# EAGLE design breakout (EAGLE 7.5.0)
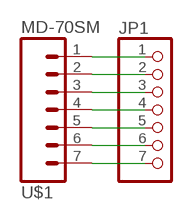
[diagram p0: schematic, sheet 1]

## Parts
JP1  PINHD-1X7  [1X07]
U$1  MD-70SM  [MD-70SM]

## Nets
N$1: JP1.7 U$1.7
N$2: JP1.5 U$1.5
N$3: JP1.6 U$1.6
N$4: JP1.3 U$1.3
N$5: JP1.1 U$1.1
N$6: JP1.2 U$1.2
N$7: JP1.4 U$1.4

## Library data of the parts
JP1 = pinhead:PINHD-1X7: PIN HEADER
U$1 = con-cui:MD-70SM

## Board
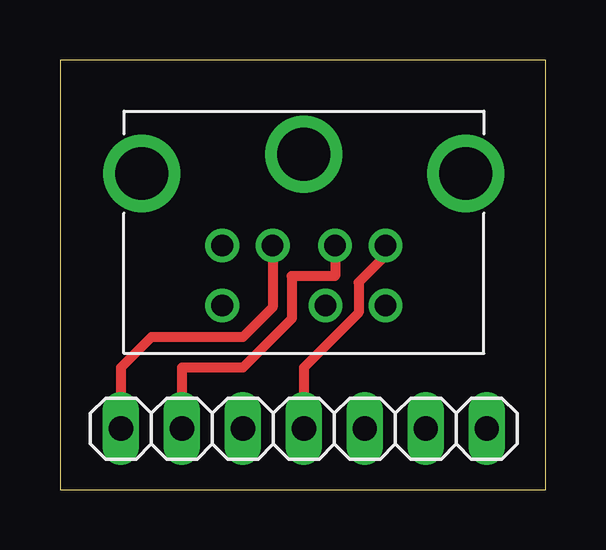
[diagram p1: board, top side]
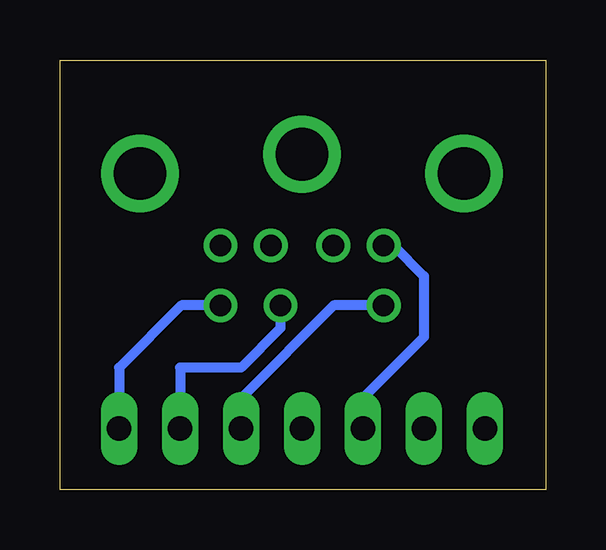
[diagram p2: board, bottom side, seen from below]

Size 20.24 x 17.9 mm. Coordinates in mm from the lower left corner, seen from the top.
Outline: 0,0 20.24,0 20.24,17.9 0,17.9 0,0
Copper layers (1*16): Top 0.035mm / dielectric 1.5mm / Bottom 0.035mm
Design rules "default": minimum track width 10mil, minimum drill 24mil, track to track 8mil, track to pad 8mil, pad to pad 8mil, via to via 8mil, smd to smd 8mil, copper to edge 40mil, drill to drill 8mil, minimum pad ring 10mil, minimum via ring 8mil, stop-mask expansion 4mil, vias tented up to drill 0mil, thermal gap 10mil

### Footprints (pad centres in the part's own frame; a part is rotated, then mirrored left to right if it is on the bottom)
1X07 = drill 1.016 long: 1 -7.62,0; 2 -5.08,0; 3 -2.54,0; 4 0,0; 5 2.54,0; 6 5.08,0; 7 7.62,0
MD-70SM = drill 0.9: 1 -1.3,-3.8; 2 1.3,-3.8; 3 -3.4,-3.8; 4 3.4,-3.8; 5 -3.4,-6.3; 6 0.9,-6.3; 7 3.4,-6.3 | drill 2.2: P$1 0,0; P$2 -6.75,-0.8; P$3 6.75,-0.8

### Placement (x,y rotation side)
JP1  10.16,2.54 0 top
U$1  10.16,13.97 0 top

### Tracks (layer width: path | path; a pad name or v marks a point on that pad's centre or on a via)
N$1
  Bottom 0.406: U$1.7 15.19,7.67 17.78,5.08 JP1.7
N$2
  Bottom 0.406: U$1.5 8.84,7.67 12.7,3.81 JP1.5
N$3
  Bottom 0.406: U$1.6 11.06,6.72 12.7,5.08 15.24,5.08 JP1.6
N$4
  Bottom 0.406: U$1.3 6.36,10.17 5.08,8.89 5.08,6.35 7.62,3.81 JP1.3
N$5
  Top 0.406: U$1.1 8.86,7.59 7.62,6.35 3.81,6.35 2.54,5.08 JP1.1
N$6
  Top 0.406: U$1.2 11.46,8.89 9.65,8.89 9.65,7.11 7.62,5.08 5.08,5.08 JP1.2
N$7
  Top 0.406: U$1.4 13.56,9.75 12.45,8.64 12.45,7.37 10.16,5.08 JP1.4